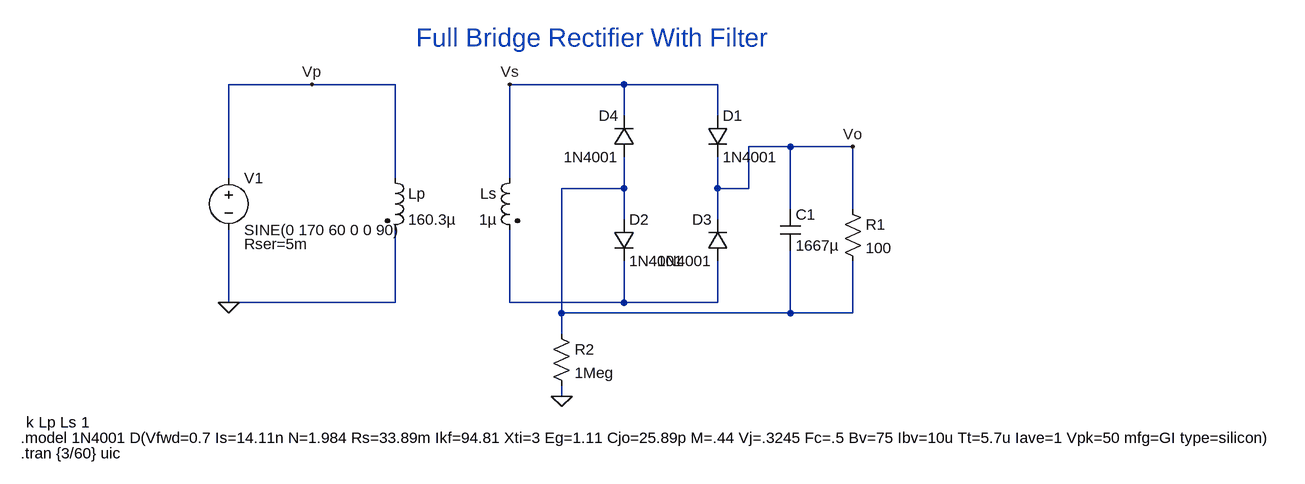
[diagram p0: schematic FullBridgeWithFilter.asc]
FullBridgeWithFilter.asc, the LTspice schematic file:
Version 4
SHEET 1 1716 680
WIRE 464 0 336 0
WIRE 592 0 464 0
WIRE 944 0 768 0
WIRE 1088 0 944 0
WIRE 944 48 944 0
WIRE 1088 48 1088 0
WIRE 1200 96 1136 96
WIRE 1296 96 1200 96
WIRE 336 144 336 0
WIRE 592 144 592 0
WIRE 768 144 768 0
WIRE 944 160 944 112
WIRE 944 160 848 160
WIRE 1088 160 1088 112
WIRE 1136 160 1136 96
WIRE 1136 160 1088 160
WIRE 1200 192 1200 96
WIRE 1296 192 1296 96
WIRE 944 208 944 160
WIRE 1088 208 1088 160
WIRE 336 336 336 224
WIRE 592 336 592 224
WIRE 592 336 336 336
WIRE 768 336 768 224
WIRE 944 336 944 272
WIRE 944 336 768 336
WIRE 1088 336 1088 272
WIRE 1088 336 944 336
WIRE 848 352 848 160
WIRE 1200 352 1200 256
WIRE 1200 352 848 352
WIRE 1296 352 1296 272
WIRE 1296 352 1200 352
WIRE 848 384 848 352
WIRE 848 480 848 464
FLAG 848 480 0
FLAG 336 336 0
FLAG 464 0 Vp
FLAG 768 0 Vs
FLAG 1296 96 Vo
SYMBOL voltage 336 128 R0
WINDOW 123 0 0 Left 0
WINDOW 39 24 118 Left 2
SYMATTR SpiceLine Rser=5m
SYMATTR InstName V1
SYMATTR Value SINE(0 170 60 0 0 90)
SYMBOL ind2 576 128 R0
SYMATTR InstName Lp
SYMATTR Value 160.3µ
SYMATTR Type ind
SYMBOL ind2 784 128 M0
SYMATTR InstName Ls
SYMATTR Value 1µ
SYMATTR Type ind
SYMBOL diode 1072 48 R0
SYMATTR InstName D1
SYMATTR Value 1N4001
SYMBOL diode 928 208 R0
SYMATTR InstName D2
SYMATTR Value 1N4001
SYMBOL diode 1104 272 R180
WINDOW 0 24 64 Left 2
WINDOW 3 24 0 Left 2
SYMATTR InstName D3
SYMATTR Value 1N4001
SYMBOL diode 960 112 R180
WINDOW 0 24 64 Left 2
WINDOW 3 24 0 Left 2
SYMATTR InstName D4
SYMATTR Value 1N4001
SYMBOL cap 1184 192 R0
SYMATTR InstName C1
SYMATTR Value 1667µ
SYMBOL res 1280 176 R0
SYMATTR InstName R1
SYMATTR Value 100
SYMBOL res 832 368 R0
SYMATTR InstName R2
SYMATTR Value 1Meg
TEXT 16 544 Left 2 !.model 1N4001 D(Vfwd=0.7 Is=14.11n N=1.984 Rs=33.89m Ikf=94.81 Xti=3 Eg=1.11 Cjo=25.89p M=.44 Vj=.3245 Fc=.5 Bv=75 Ibv=10u Tt=5.7u Iave=1 Vpk=50 mfg=GI type=silicon)
TEXT 24 520 Left 2 !k Lp Ls 1
TEXT 16 568 Left 2 !.tran {3/60} uic
TEXT 624 -72 Left 4 ;Full Bridge Rectifier With Filter

The netlist it stands for:
* FullBridgeWithFilter.asc
V1 Vp 0 SINE(0 170 60 0 0 90) Rser=5m
Lp Vp 0 160.3µ
Ls Vs N002 1µ
D1 Vs Vo 1N4001
D2 N001 N002 1N4001
D3 N002 Vo 1N4001
D4 N001 Vs 1N4001
C1 Vo N001 1667µ
R1 Vo N001 100
R2 N001 0 1Meg
.model D D
.lib standard.dio
.model 1N4001 D(Vfwd=0.7 Is=14.11n N=1.984 Rs=33.89m Ikf=94.81 Xti=3 Eg=1.11 Cjo=25.89p M=.44 Vj=.3245 Fc=.5 Bv=75 Ibv=10u Tt=5.7u Iave=1 Vpk=50 mfg=GI type=silicon)
k Lp Ls 1
.tran {3/60} uic
* Full Bridge Rectifier With Filter
.backanno
.end